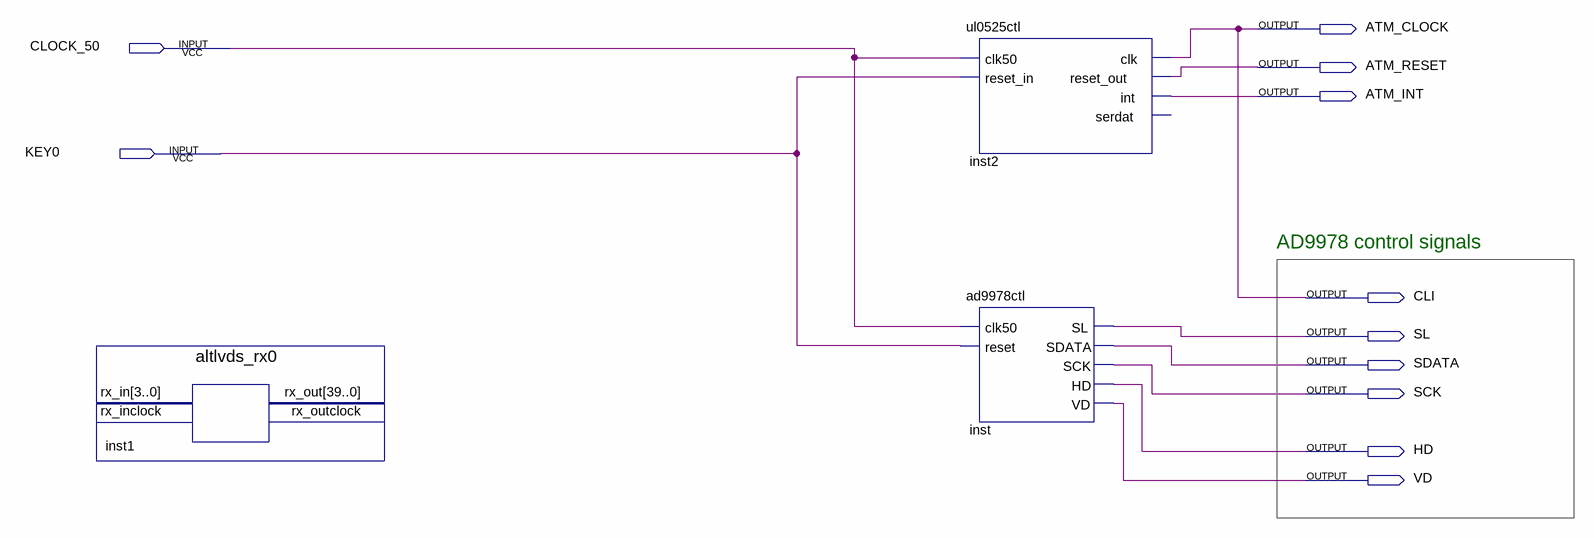
[diagram p0: schematic sheet]
// Quartus schematic apex.bdf as structural Verilog: 3 symbols, 11 pins
module apex (
  input  CLOCK_50,
  input  KEY0,
  output ATM_CLOCK,
  output ATM_RESET,
  output ATM_INT,
  output CLI,
  output SL,
  output SDATA,
  output SCK,
  output HD,
  output VD
);

  altlvds_rx0 inst1 ();  // open: rx_in, rx_inclock, rx_out, rx_outclock
  ul0525ctl inst2 (
    .clk50(CLOCK_50), .reset_in(KEY0), .clk(ATM_CLOCK), .reset_out(ATM_RESET), .\int (ATM_INT));  // open: serdat
  ad9978ctl inst (.clk50(CLOCK_50), .reset(KEY0), .SL(SL), .SDATA(SDATA), .SCK(SCK), .HD(HD), .VD(VD));

  assign CLI = ATM_CLOCK;

  // Notes on the sheet:
  //   AD9978 control signals
endmodule
